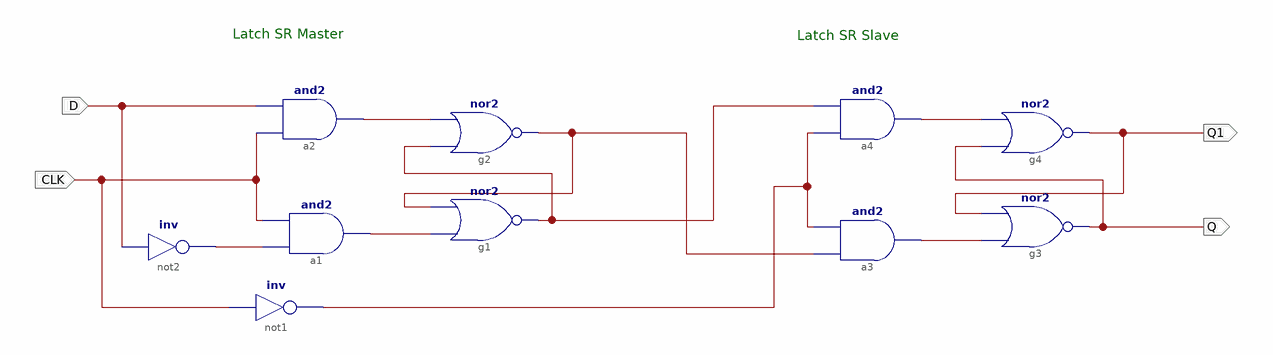
[diagram p0: schematic sheet 1]
// Xilinx ISE schematic SamiMasterSlave.sch (spartan3e) as structural Verilog: 10 symbols, 4 ports
module SamiMasterSlave (
  input  CLK,
  input  D,
  output Q,
  output Q1
);

  wire XLXN_1, XLXN_2, XLXN_4, XLXN_5, XLXN_27, XLXN_28, XLXN_29, XLXN_41;

  nor g2 (XLXN_1, XLXN_2, XLXN_5);
  nor g1 (XLXN_2, XLXN_4, XLXN_1);
  and a2 (XLXN_5, CLK, D);
  and a1 (XLXN_4, XLXN_27, CLK);
  not not2 (XLXN_27, D);
  nor g4 (Q1, Q, XLXN_29);
  nor g3 (Q, XLXN_28, Q1);
  and a4 (XLXN_29, XLXN_41, XLXN_2);
  and a3 (XLXN_28, XLXN_1, XLXN_41);
  not not1 (XLXN_41, CLK);

  // Notes on the sheet:
  //   Latch SR Master
  //   Latch SR Slave
endmodule
